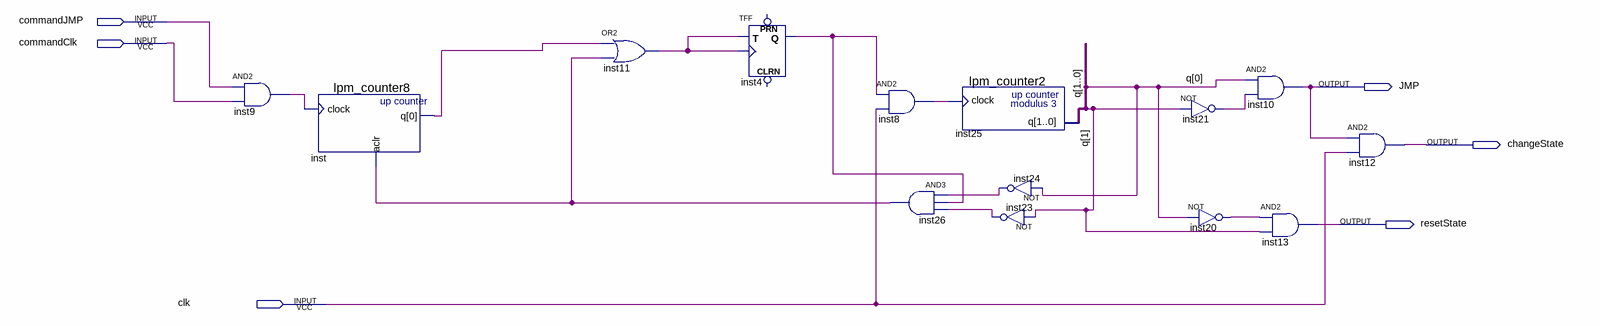
[diagram p0: schematic sheet]
// Quartus schematic JMP.bdf as structural Verilog: 14 symbols, 6 pins
module JMP (
  input  commandJMP,
  input  commandClk,
  input  clk,
  output JMP,
  output changeState,
  output resetState
);

  wire inst4_q, inst8_out, inst9_out, inst11_out, inst20_out, inst21_out, inst23_out, inst24_out, inst26_out,
       inst_q;
  wire [1:0] q;

  and inst9 (inst9_out, commandJMP, commandClk);
  lpm_counter8 inst (.clock(inst9_out), .aclr(inst26_out), .q(inst_q));
  or inst11 (inst11_out, inst_q, inst26_out);
  TFF inst4 (.T(inst11_out), .CLK(inst11_out), .Q(inst4_q));  // open: PRN, CLRN
  and inst8 (inst8_out, inst4_q, clk);
  and inst26 (inst26_out, inst24_out, inst4_q, inst23_out);
  lpm_counter2 inst25 (.clock(inst8_out), .q(q));
  not inst24 (inst24_out, q[0]);
  not inst23 (inst23_out, q[1]);
  not inst21 (inst21_out, q[1]);
  not inst20 (inst20_out, q[0]);
  and inst10 (JMP, q[0], inst21_out);
  and inst13 (resetState, inst20_out, q[1]);
  and inst12 (changeState, JMP, clk);
endmodule
